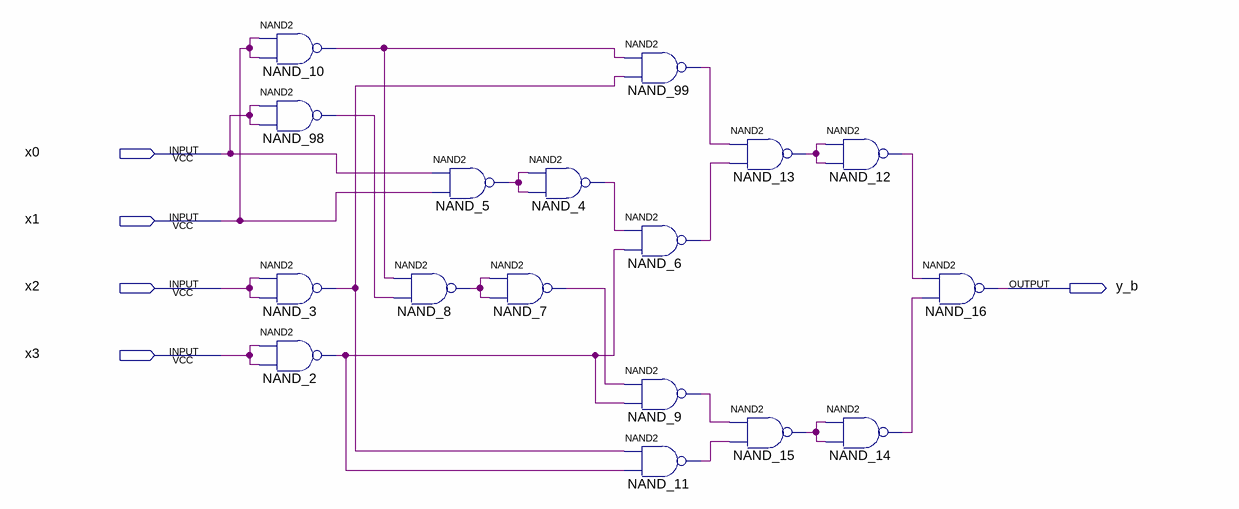
[diagram p0: schematic sheet]
// Quartus schematic b_schema.bdf as structural Verilog: 17 symbols, 5 pins
module b_schema (
  input  x0,
  input  x1,
  input  x2,
  input  x3,
  output y_b
);

  wire NAND_2_out, NAND_3_out, NAND_4_out, NAND_5_out, NAND_6_out, NAND_7_out, NAND_8_out, NAND_9_out,
       NAND_10_out, NAND_11_out, NAND_12_out, NAND_13_out, NAND_14_out, NAND_15_out, NAND_98_out, NAND_99_out;

  nand NAND_10 (NAND_10_out, x1, x1);
  nand NAND_98 (NAND_98_out, x0, x0);
  nand NAND_3 (NAND_3_out, x2, x2);
  nand NAND_2 (NAND_2_out, x3, x3);
  nand NAND_8 (NAND_8_out, NAND_10_out, NAND_98_out);
  nand NAND_5 (NAND_5_out, x0, x1);
  nand NAND_4 (NAND_4_out, NAND_5_out, NAND_5_out);
  nand NAND_7 (NAND_7_out, NAND_8_out, NAND_8_out);
  nand NAND_99 (NAND_99_out, NAND_10_out, NAND_3_out);
  nand NAND_6 (NAND_6_out, NAND_4_out, NAND_2_out);
  nand NAND_9 (NAND_9_out, NAND_7_out, NAND_2_out);
  nand NAND_11 (NAND_11_out, NAND_3_out, NAND_2_out);
  nand NAND_13 (NAND_13_out, NAND_99_out, NAND_6_out);
  nand NAND_15 (NAND_15_out, NAND_9_out, NAND_11_out);
  nand NAND_12 (NAND_12_out, NAND_13_out, NAND_13_out);
  nand NAND_14 (NAND_14_out, NAND_15_out, NAND_15_out);
  nand NAND_16 (y_b, NAND_12_out, NAND_14_out);
endmodule
